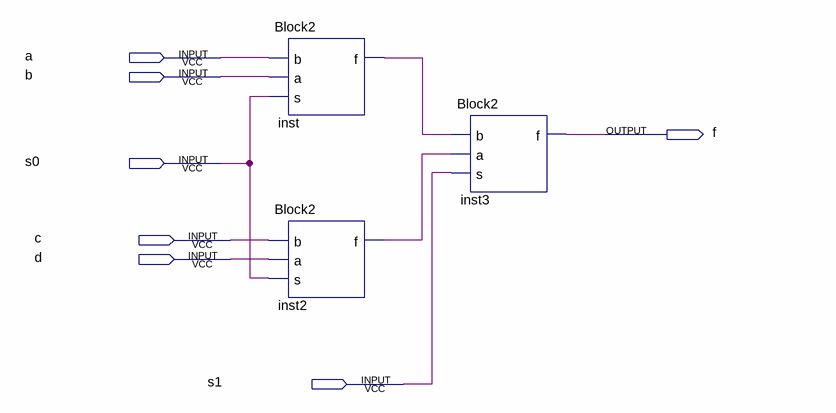
[diagram p0: schematic sheet]
// Quartus schematic Block3.bdf as structural Verilog: 3 symbols, 7 pins
module Block3 (
  input  a,
  input  b,
  input  s0,
  input  c,
  input  d,
  input  s1,
  output f
);

  wire inst2_f, inst_f;

  Block2 inst (.b(a), .a(b), .s(s0), .f(inst_f));
  Block2 inst2 (.b(c), .a(d), .s(s0), .f(inst2_f));
  Block2 inst3 (.b(inst_f), .a(inst2_f), .s(s1), .f(f));
endmodule
